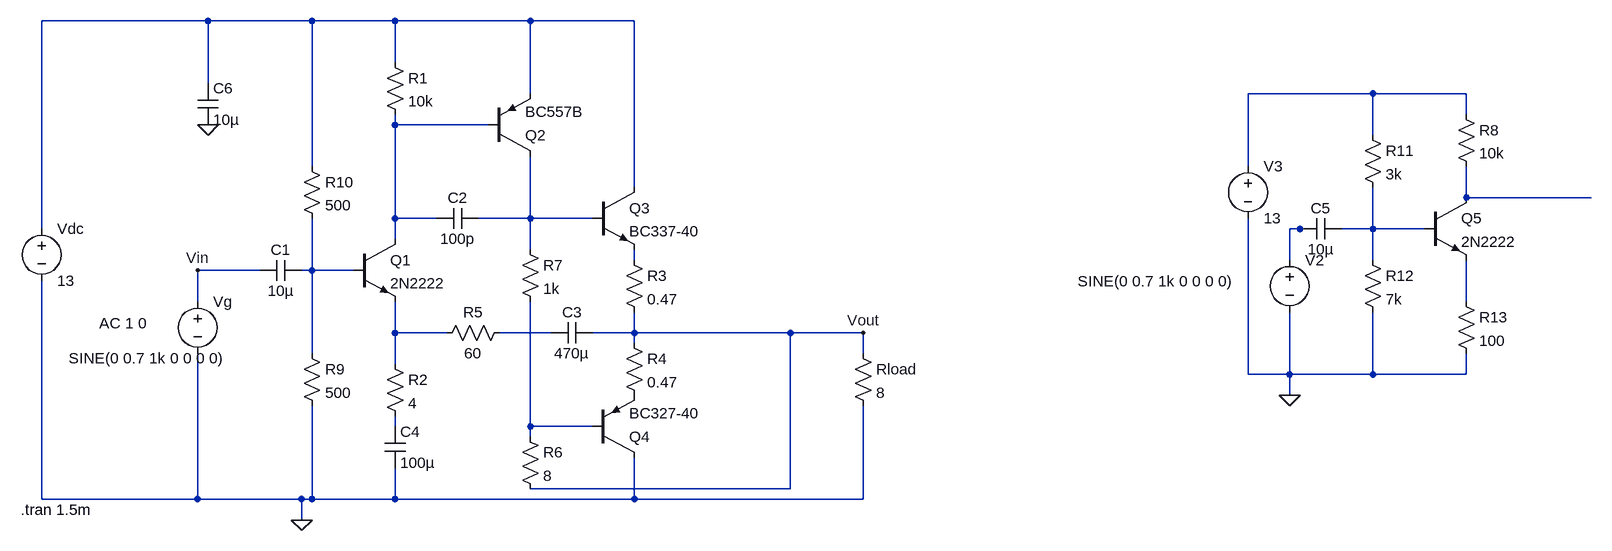
[diagram p0: schematic CircCompletoAmpliAudio.asc]
CircCompletoAmpliAudio.asc, the LTspice schematic file:
Version 4
SHEET 1 2240 680
WIRE -48 -320 -304 -320
WIRE 112 -320 -48 -320
WIRE 240 -320 112 -320
WIRE 448 -320 240 -320
WIRE 608 -320 448 -320
WIRE 240 -256 240 -320
WIRE -48 -224 -48 -320
WIRE 448 -208 448 -320
WIRE 1744 -208 1552 -208
WIRE 1888 -208 1744 -208
WIRE 1888 -176 1888 -208
WIRE 240 -160 240 -176
WIRE 384 -160 240 -160
WIRE 1744 -144 1744 -208
WIRE 112 -96 112 -320
WIRE 1552 -96 1552 -208
WIRE 608 -64 608 -320
WIRE 1888 -48 1888 -96
WIRE 2080 -48 1888 -48
WIRE 240 -16 240 -160
WIRE 304 -16 240 -16
WIRE 448 -16 448 -112
WIRE 448 -16 368 -16
WIRE 544 -16 448 -16
WIRE -304 0 -304 -320
WIRE 1632 0 1616 0
WIRE 1648 0 1632 0
WIRE 1744 0 1744 -64
WIRE 1744 0 1696 0
WIRE 1824 0 1744 0
WIRE 240 16 240 -16
WIRE 448 32 448 -16
WIRE 608 48 608 32
WIRE 1616 48 1616 0
WIRE 1744 48 1744 0
WIRE 32 64 -64 64
WIRE 112 64 112 -16
WIRE 112 64 96 64
WIRE 176 64 112 64
WIRE -64 112 -64 64
WIRE 1888 112 1888 48
WIRE 240 160 240 112
WIRE 320 160 240 160
WIRE 480 160 400 160
WIRE 608 160 608 128
WIRE 608 160 544 160
WIRE 848 160 608 160
WIRE 960 160 848 160
WIRE 608 176 608 160
WIRE 112 192 112 64
WIRE 960 192 960 160
WIRE 240 208 240 160
WIRE 1552 224 1552 -16
WIRE 1616 224 1616 128
WIRE 1616 224 1552 224
WIRE 1744 224 1744 128
WIRE 1744 224 1616 224
WIRE 1888 224 1888 192
WIRE 1888 224 1744 224
WIRE 1616 256 1616 224
WIRE 240 304 240 288
WIRE 448 304 448 112
WIRE 544 304 448 304
WIRE 448 320 448 304
WIRE 848 400 848 160
WIRE 848 400 448 400
WIRE -304 416 -304 80
WIRE -64 416 -64 192
WIRE -64 416 -304 416
WIRE 96 416 -64 416
WIRE 112 416 112 272
WIRE 112 416 96 416
WIRE 240 416 240 368
WIRE 240 416 112 416
WIRE 608 416 608 352
WIRE 608 416 240 416
WIRE 960 416 960 272
WIRE 960 416 608 416
WIRE 96 448 96 416
FLAG 960 160 Vout
FLAG -64 64 Vin
FLAG 1616 256 0
FLAG 96 448 0
FLAG -48 -160 0
SYMBOL voltage -64 96 R0
WINDOW 3 -198 103 Left 2
WINDOW 123 -151 49 Left 2
WINDOW 39 0 0 Left 0
SYMATTR Value SINE(0 0.7 1k 0 0 0 0)
SYMATTR Value2 AC 1 0
SYMATTR InstName Vg
SYMBOL npn 176 16 R0
SYMATTR InstName Q1
SYMATTR Value 2N2222
SYMBOL res 224 -272 R0
SYMATTR InstName R1
SYMATTR Value 10k
SYMBOL res 224 192 R0
SYMATTR InstName R2
SYMATTR Value 4
SYMBOL cap 368 -32 R90
WINDOW 0 0 32 VBottom 2
WINDOW 3 32 32 VTop 2
SYMATTR InstName C2
SYMATTR Value 100p
SYMBOL res 944 176 R0
SYMATTR InstName Rload
SYMATTR Value 8
SYMBOL cap 544 144 R90
WINDOW 0 0 32 VBottom 2
WINDOW 3 32 32 VTop 2
SYMATTR InstName C3
SYMATTR Value 470µ
SYMBOL pnp 384 -112 M180
SYMATTR InstName Q2
SYMATTR Value BC557B
SYMBOL res 416 144 R90
WINDOW 0 0 56 VBottom 2
WINDOW 3 32 56 VTop 2
SYMATTR InstName R5
SYMATTR Value 60
SYMBOL cap 224 304 R0
SYMATTR InstName C4
SYMATTR Value 100µ
SYMBOL voltage -304 -16 R0
SYMATTR InstName Vdc
SYMATTR Value 13
SYMBOL npn 544 -64 R0
SYMATTR InstName Q3
SYMATTR Value BC337-40
SYMBOL res 592 32 R0
SYMATTR InstName R3
SYMATTR Value 0.47
SYMBOL pnp 544 352 M180
SYMATTR InstName Q4
SYMATTR Value BC327-40
SYMBOL res 592 160 R0
SYMATTR InstName R4
SYMATTR Value 0.47
SYMBOL res 432 16 R0
SYMATTR InstName R7
SYMATTR Value 1k
SYMBOL res 432 304 R0
SYMATTR InstName R6
SYMATTR Value 8
SYMBOL npn 1824 -48 R0
SYMATTR InstName Q5
SYMATTR Value 2N2222
SYMBOL voltage 1616 32 R0
WINDOW 123 0 0 Left 0
WINDOW 39 0 0 Left 0
WINDOW 3 -326 49 Left 2
SYMATTR Value SINE(0 0.7 1k 0 0 0 0)
SYMATTR InstName V2
SYMBOL res 1872 -192 R0
SYMATTR InstName R8
SYMATTR Value 10k
SYMBOL voltage 1552 -112 R0
WINDOW 123 0 0 Left 0
WINDOW 39 0 0 Left 0
SYMATTR InstName V3
SYMATTR Value 13
SYMBOL cap 1696 -16 R90
WINDOW 0 0 32 VBottom 2
WINDOW 3 32 32 VTop 2
SYMATTR InstName C5
SYMATTR Value 10µ
SYMBOL res 1728 -160 R0
SYMATTR InstName R11
SYMATTR Value 3k
SYMBOL res 1728 32 R0
SYMATTR InstName R12
SYMATTR Value 7k
SYMBOL res 1872 96 R0
SYMATTR InstName R13
SYMATTR Value 100
SYMBOL cap 96 48 R90
WINDOW 0 0 32 VBottom 2
WINDOW 3 32 32 VTop 2
SYMATTR InstName C1
SYMATTR Value 10µ
SYMBOL cap -64 -224 R0
SYMATTR InstName C6
SYMATTR Value 10µ
SYMBOL res 96 176 R0
SYMATTR InstName R9
SYMATTR Value 500
SYMBOL res 96 -112 R0
SYMATTR InstName R10
SYMATTR Value 500
TEXT -336 432 Left 2 !.tran 1.5m

The netlist it stands for:
* CircCompletoAmpliAudio.asc
Vg Vin 0 SINE(0 0.7 1k 0 0 0 0) AC 1 0
Q1 N003 N009 N011 0 2N2222
R1 N001 N003 10k
R2 N011 N013 4
C2 N005 N003 100p
Rload Vout 0 8
C3 Vout N012 470µ
Q2 N005 N003 N001 0 BC557B
R5 N012 N011 60
C4 N013 0 100µ
Vdc N001 0 13
Q3 N001 N005 N008 0 BC337-40
R3 N008 Vout 0.47
Q4 0 N014 P001 0 BC327-40
R4 Vout P001 0.47
R7 N005 N014 1k
R6 N014 Vout 8
Q5 N004 N007 N010 0 2N2222
V2 N006 0 SINE(0 0.7 1k 0 0 0 0)
R8 N002 N004 10k
V3 N002 0 13
C5 N007 N006 10µ
R11 N002 N007 3k
R12 N007 0 7k
R13 N010 0 100
C1 N009 Vin 10µ
C6 N001 0 10µ
R9 N009 0 500
R10 N001 N009 500
.model NPN NPN
.model PNP PNP
.lib standard.bjt
.tran 1.5m
.backanno
.end